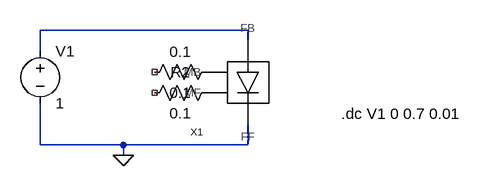
[diagram p0: schematic solar_subckt_test.asc]
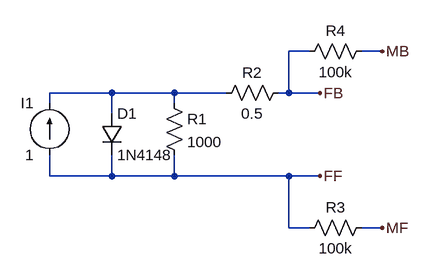
[diagram p1: sub-circuit solar_cell_4_wire.asc]
solar_subckt_test.asc, the LTspice schematic file:
Version 4
SHEET 1 880 680
WIRE 272 96 -48 96
WIRE 272 112 272 96
WIRE -48 128 -48 96
WIRE -48 272 -48 208
WIRE 80 272 -48 272
WIRE 272 272 272 240
WIRE 272 272 80 272
WIRE 80 288 80 272
FLAG 80 288 0
SYMBOL Solar_cell_4_wire 272 224 R180
SYMATTR InstName X1
SYMBOL voltage -48 112 R0
WINDOW 123 0 0 Left 0
WINDOW 39 0 0 Left 0
SYMATTR InstName V1
SYMATTR Value 1
SYMBOL res 224 144 R90
WINDOW 0 0 56 VBottom 2
WINDOW 3 32 56 VTop 2
SYMATTR InstName 0.1
SYMATTR Value 0.1
SYMBOL res 224 176 R90
WINDOW 0 0 56 VBottom 2
WINDOW 3 32 56 VTop 2
SYMATTR InstName R2
SYMATTR Value 0.1
TEXT 416 224 Left 2 !.dc V1 0 0.7 0.01

solar_cell_4_wire.asc, the sub-circuit schematic file:
Version 4
SHEET 1 880 680
WIRE 416 32 384 32
WIRE 528 32 496 32
WIRE 112 96 16 96
WIRE 208 96 112 96
WIRE 288 96 208 96
WIRE 384 96 384 32
WIRE 384 96 368 96
WIRE 432 96 384 96
WIRE 16 112 16 96
WIRE 208 112 208 96
WIRE 112 128 112 96
WIRE 16 224 16 192
WIRE 112 224 112 192
WIRE 112 224 16 224
WIRE 208 224 208 192
WIRE 208 224 112 224
WIRE 384 224 208 224
WIRE 432 224 384 224
WIRE 384 304 384 224
WIRE 416 304 384 304
WIRE 528 304 496 304
FLAG 432 96 FB
FLAG 432 224 FF
FLAG 528 32 MB
FLAG 528 304 MF
SYMBOL current 16 192 R180
WINDOW 0 24 80 Left 2
WINDOW 3 24 0 Left 2
WINDOW 123 0 0 Left 0
WINDOW 39 0 0 Left 0
SYMATTR InstName I1
SYMATTR Value 1
SYMBOL diode 96 128 R0
SYMATTR InstName D1
SYMATTR Value 1N4148
SYMBOL res 192 96 R0
SYMATTR InstName R1
SYMATTR Value 1000
SYMBOL res 384 80 R90
WINDOW 0 0 56 VBottom 2
WINDOW 3 32 56 VTop 2
SYMATTR InstName R2
SYMATTR Value 0.5
SYMBOL res 512 288 R90
WINDOW 0 0 56 VBottom 2
WINDOW 3 32 56 VTop 2
SYMATTR InstName R3
SYMATTR Value 100k
SYMBOL res 512 16 R90
WINDOW 0 0 56 VBottom 2
WINDOW 3 32 56 VTop 2
SYMATTR InstName R4
SYMATTR Value 100k

The netlist it stands for:
* solar_subckt_test.asc
XX1 0 N001 P001 P002 solar_cell_4_wire
V1 N001 0 1
R§0.1 P002 NC_01 0.1
R2 P001 NC_02 0.1

* block symbol definitions
.subckt solar_cell_4_wire FF FB MF MB
I1 FF N001 1
D1 N001 FF 1N4148
R1 N001 FF 1000
R2 FB N001 0.5
R3 MF FF 100k
R4 MB FB 100k
.ends solar_cell_4_wire

.model D D
.lib standard.dio
.dc V1 0 0.7 0.01
.backanno
.end